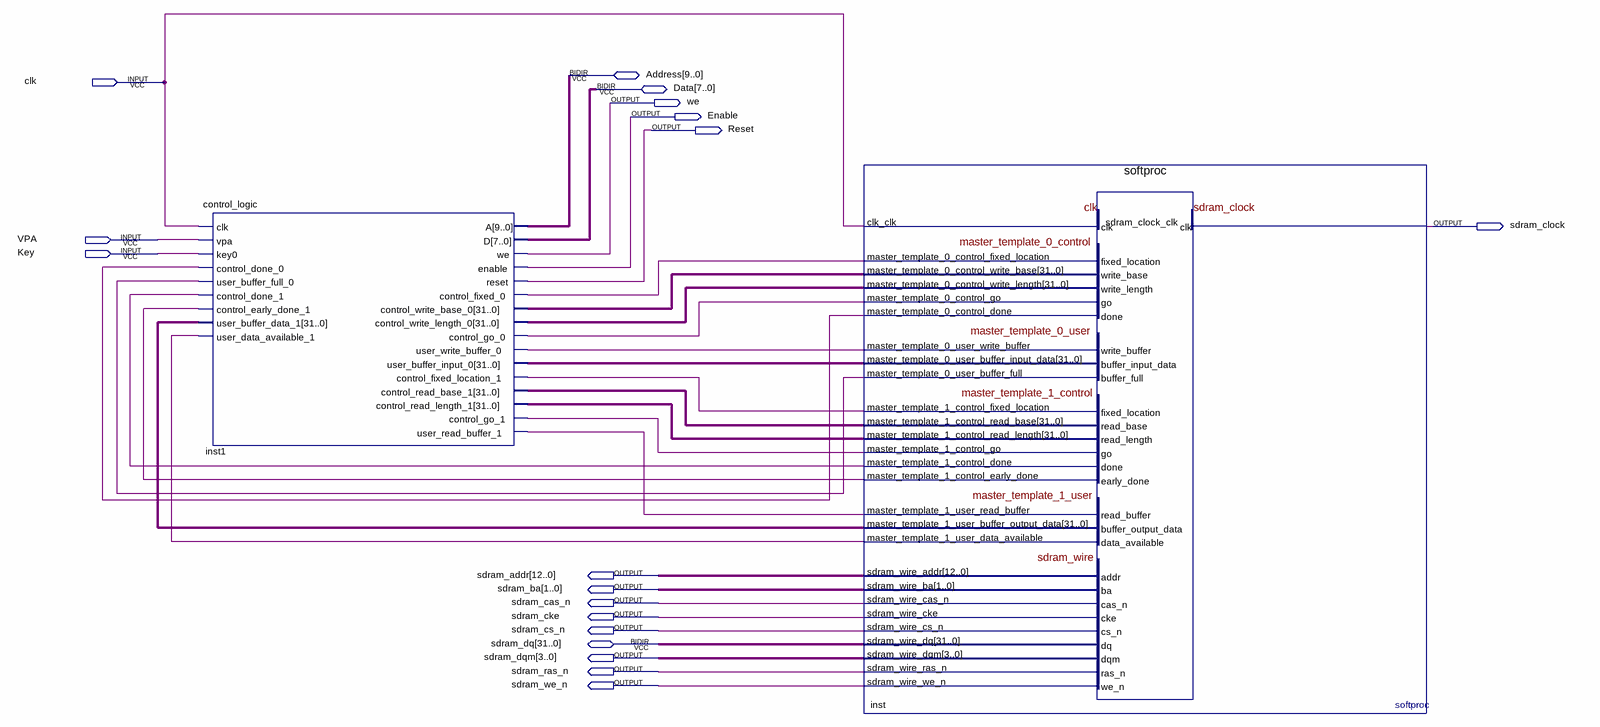
[diagram p0: schematic sheet]
// Quartus schematic block.bdf as structural Verilog: 2 symbols, 18 pins
module block (
  input  clk,
  input  VPA,
  input  Key,
  inout  [9:0] Address,
  inout  [7:0] Data,
  inout  [31:0] sdram_dq,
  output we,
  output Enable,
  output Reset,
  output sdram_clock,
  output [12:0] sdram_addr,
  output [1:0] sdram_ba,
  output sdram_cas_n,
  output sdram_cke,
  output sdram_cs_n,
  output [3:0] sdram_dqm,
  output sdram_ras_n,
  output sdram_we_n
);

  wire inst1_control_fixed_0, inst1_control_fixed_location_1, inst1_control_go_0, inst1_control_go_1,
       inst1_user_read_buffer_1, inst1_user_write_buffer_0, inst_master_template_0_control_done,
       inst_master_template_0_user_buffer_full, inst_master_template_1_control_done,
       inst_master_template_1_control_early_done, inst_master_template_1_user_data_available;
  wire [31:0] inst1_control_read_base_1, inst1_control_read_length_1, inst1_control_write_base_0,
       inst1_control_write_length_0, inst1_user_buffer_input_0,
       inst_master_template_1_user_buffer_output_data;

  control_logic inst1 (
    .clk(clk), .vpa(VPA), .key0(Key), .control_done_0(inst_master_template_0_control_done),
    .user_buffer_full_0(inst_master_template_0_user_buffer_full),
    .control_done_1(inst_master_template_1_control_done),
    .control_early_done_1(inst_master_template_1_control_early_done),
    .user_buffer_data_1(inst_master_template_1_user_buffer_output_data),
    .user_data_available_1(inst_master_template_1_user_data_available), .we(we), .enable(Enable),
    .reset(Reset), .control_fixed_0(inst1_control_fixed_0),
    .control_write_base_0(inst1_control_write_base_0), .control_write_length_0(inst1_control_write_length_0),
    .control_go_0(inst1_control_go_0), .user_write_buffer_0(inst1_user_write_buffer_0),
    .user_buffer_input_0(inst1_user_buffer_input_0),
    .control_fixed_location_1(inst1_control_fixed_location_1),
    .control_read_base_1(inst1_control_read_base_1), .control_read_length_1(inst1_control_read_length_1),
    .control_go_1(inst1_control_go_1), .user_read_buffer_1(inst1_user_read_buffer_1), .A(Address), .D(Data));
  softproc inst (
    .clk_clk(clk), .master_template_0_control_fixed_location(inst1_control_fixed_0),
    .master_template_0_control_write_base(inst1_control_write_base_0),
    .master_template_0_control_write_length(inst1_control_write_length_0),
    .master_template_0_control_go(inst1_control_go_0),
    .master_template_0_user_write_buffer(inst1_user_write_buffer_0),
    .master_template_0_user_buffer_input_data(inst1_user_buffer_input_0),
    .master_template_1_control_fixed_location(inst1_control_fixed_location_1),
    .master_template_1_control_read_base(inst1_control_read_base_1),
    .master_template_1_control_read_length(inst1_control_read_length_1),
    .master_template_1_control_go(inst1_control_go_1),
    .master_template_1_user_read_buffer(inst1_user_read_buffer_1),
    .master_template_0_control_done(inst_master_template_0_control_done),
    .master_template_0_user_buffer_full(inst_master_template_0_user_buffer_full),
    .master_template_1_control_done(inst_master_template_1_control_done),
    .master_template_1_control_early_done(inst_master_template_1_control_early_done),
    .master_template_1_user_buffer_output_data(inst_master_template_1_user_buffer_output_data),
    .master_template_1_user_data_available(inst_master_template_1_user_data_available),
    .sdram_clock_clk(sdram_clock), .sdram_wire_addr(sdram_addr), .sdram_wire_ba(sdram_ba),
    .sdram_wire_cas_n(sdram_cas_n), .sdram_wire_cke(sdram_cke), .sdram_wire_cs_n(sdram_cs_n),
    .sdram_wire_dqm(sdram_dqm), .sdram_wire_ras_n(sdram_ras_n), .sdram_wire_we_n(sdram_we_n),
    .sdram_wire_dq(sdram_dq));
endmodule
